# EAGLE design USB-to-Quad-RS-485-Conv-Module (EAGLE 9.6.2)
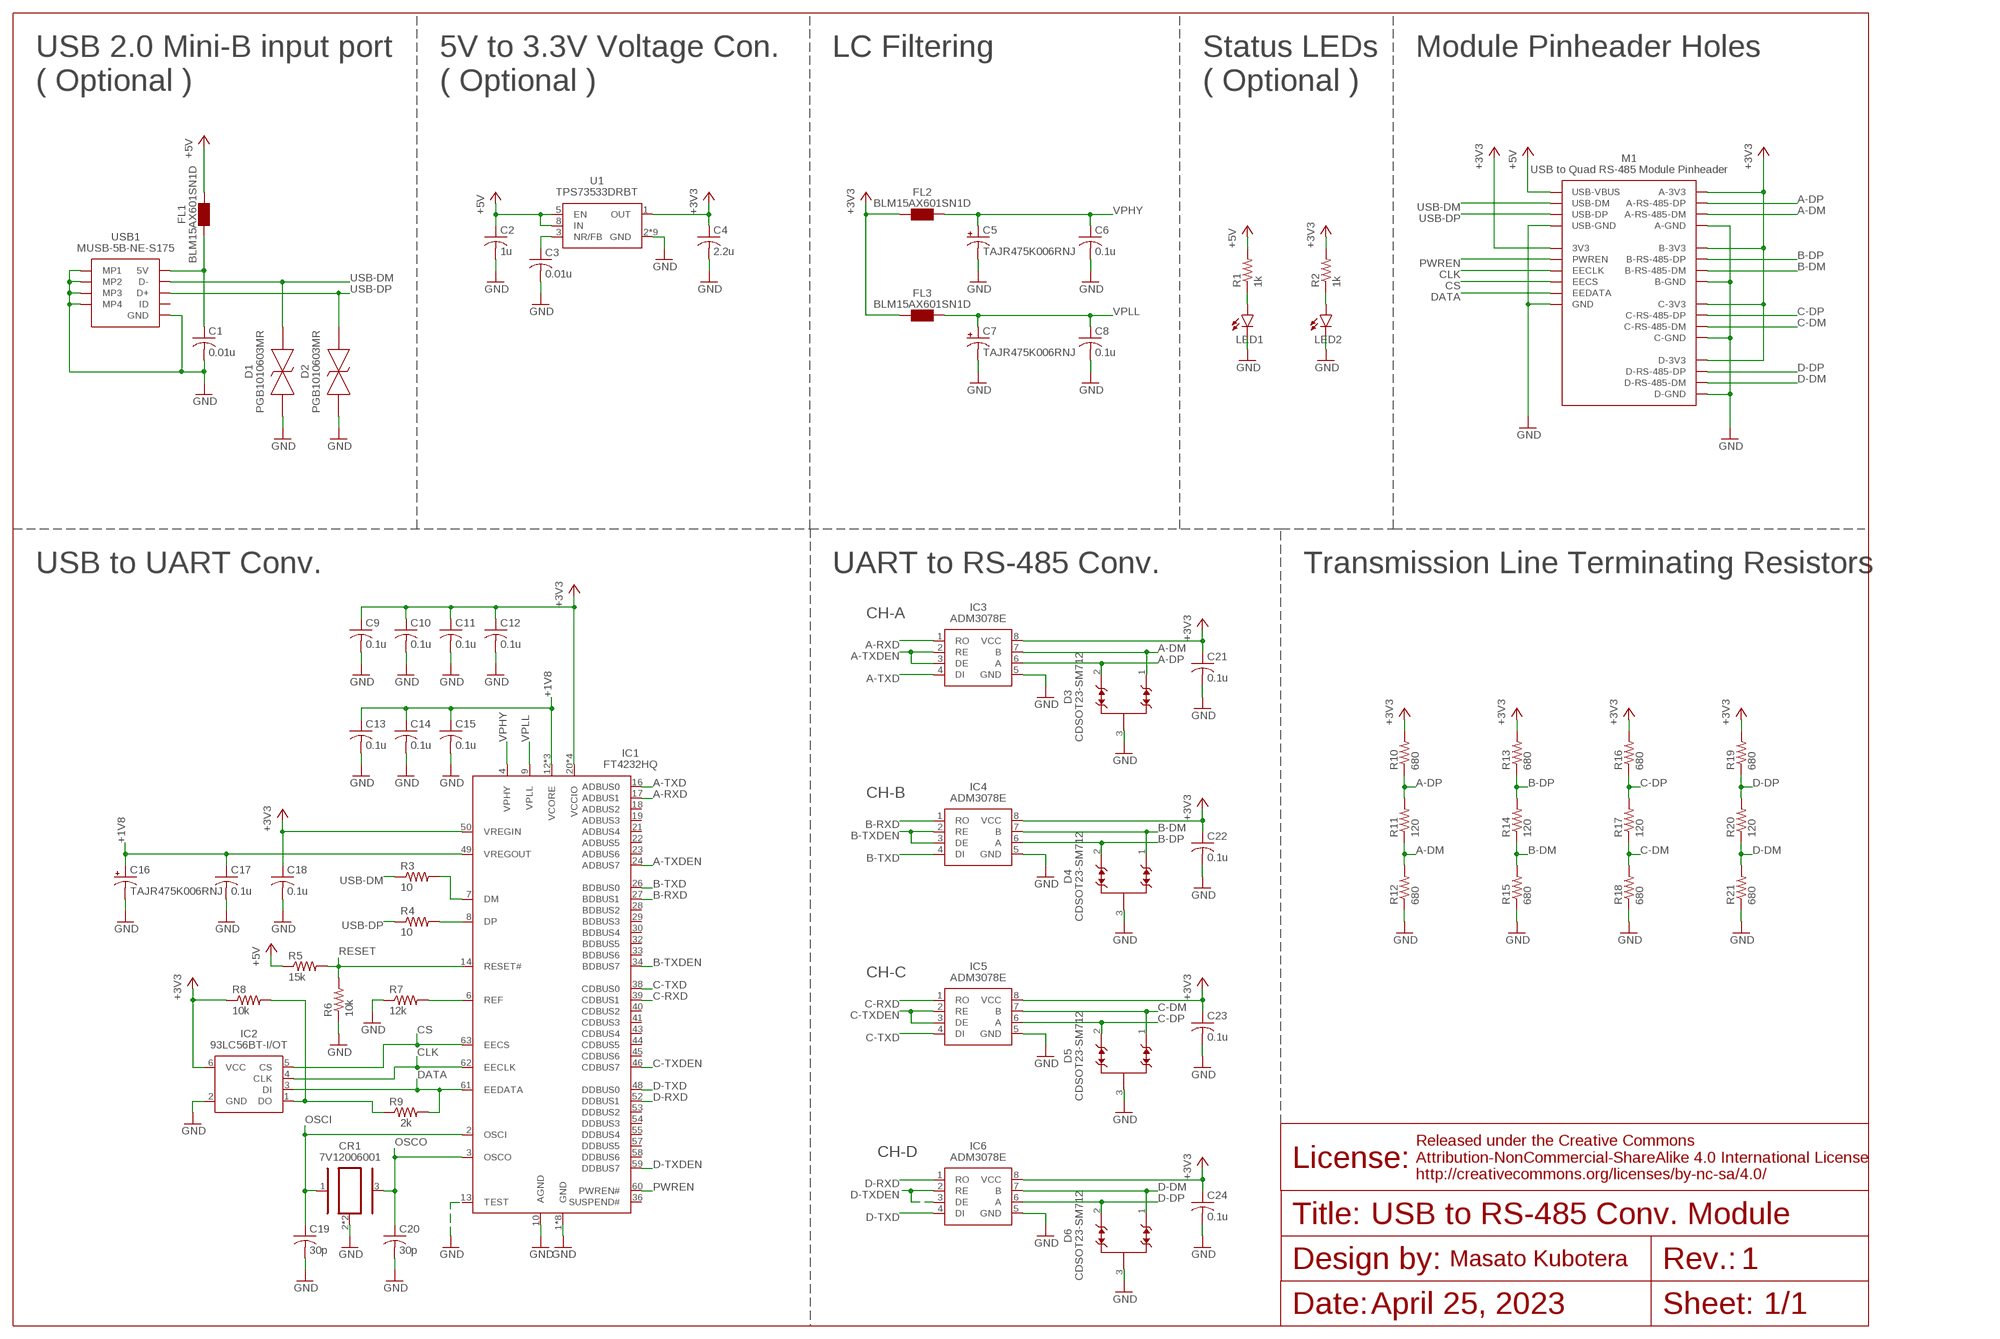
[diagram p0: schematic, sheet 1]

## Parts
C1  0.01u  C-USC0402  [C0402]
C2  1u  C-USC0402  [C0402]
C3  0.01u  C-USC0402  [C0402]
C4  2.2u  C-USC0402  [C0402]
C5  4.7u  TAJR475K006RNJ  [0805K]
C6  0.1u  C-USC0402  [C0402]
C7  4.7u  TAJR475K006RNJ  [0805K]
C8  0.1u  C-USC0402  [C0402]
C9  0.1u  C-USC0402  [C0402]
C10  0.1u  C-USC0402  [C0402]
C11  0.1u  C-USC0402  [C0402]
C12  0.1u  C-USC0402  [C0402]
C13  0.1u  C-USC0402  [C0402]
C14  0.1u  C-USC0402  [C0402]
C15  0.1u  C-USC0402  [C0402]
C16  4.7u  TAJR475K006RNJ  [0805K]
C17  0.1u  C-USC0402  [C0402]
C18  0.1u  C-USC0402  [C0402]
C19  30p  C-USC0402  [C0402]
C20  30p  C-USC0402  [C0402]
C21  0.1u  C-USC0402  [C0402]
C22  0.1u  C-USC0402  [C0402]
C23  0.1u  C-USC0402  [C0402]
C24  0.1u  C-USC0402  [C0402]
CR1  7V12006001  [7V12006001]
D1  PGB1010603MR  [0603]
D2  PGB1010603MR  [0603]
D3  CDSOT23-SM712  [SOT-23-3]
D4  CDSOT23-SM712  [SOT-23-3]
D5  CDSOT23-SM712  [SOT-23-3]
D6  CDSOT23-SM712  [SOT-23-3]
FL1  BLM15AX601SN1D  [BLM15AX601SN1D]
FL2  BLM15AX601SN1D  [BLM15AX601SN1D]
FL3  BLM15AX601SN1D  [BLM15AX601SN1D]
IC1  FT4232HQ  [FT4232HQ]
IC2  93LC56BT-I/OT  [SOT-23-6]
IC3  ADM3078E  [SOIC-8]
IC4  ADM3078E  [SOIC-8]
IC5  ADM3078E  [SOIC-8]
IC6  ADM3078E  [SOIC-8]
LED1  LEDSML0603  [SML0603]
LED2  LEDSML0603  [SML0603]
M1  USB-TO-QUAD-RS-485-CONV-MODULE  [USB-TO-QUAD-RS-485-CONV-MODULE-DIMENSION]
R1  1k  R-US_R0402  [R0402]
R2  1k  R-US_R0402  [R0402]
R3  10  R-US_R0402  [R0402]
R4  10  R-US_R0402  [R0402]
R5  15k  R-US_R0402  [R0402]
R6  10k  R-US_R0402  [R0402]
R7  12k  R-US_R0402  [R0402]
R8  10k  R-US_R0402  [R0402]
R9  2k  R-US_R0402  [R0402]
R10  680  R-US_R0402  [R0402]
R11  120  R-US_R0402  [R0402]
R12  680  R-US_R0402  [R0402]
R13  680  R-US_R0402  [R0402]
R14  120  R-US_R0402  [R0402]
R15  680  R-US_R0402  [R0402]
R16  680  R-US_R0402  [R0402]
R17  120  R-US_R0402  [R0402]
R18  680  R-US_R0402  [R0402]
R19  680  R-US_R0402  [R0402]
R20  120  R-US_R0402  [R0402]
R21  680  R-US_R0402  [R0402]
U1  TPS73533DRBT  [SON-8]
USB1  MINI_USB_B_SMD  [MINI_USB_B_SMD]

## Nets
+1V8 [power]: C13.1 C14.1 C15.1 C16.1(+) C17.1 IC1.12(VCORE) IC1.37(VCORE) IC1.49(VREGOUT) IC1.64(VCORE)
+3V3 [power]: C4.1 C9.1 C10.1 C11.1 C12.1 C18.1 C21.1 C22.1 C23.1 C24.1 FL2.1 FL3.1 IC1.20(VCCIO) IC1.31(VCCIO) IC1.42(VCCIO) IC1.50(VREGIN) IC1.56(VCCIO) IC2.6(VCC) IC3.8(VCC) IC4.8(VCC) IC5.8(VCC) IC6.8(VCC) M1.3V3 M1.A-3V3 M1.B-3.3V(B-3V3) M1.C-3V3 M1.D-3V3 R2.2 R8.1 R10.2 R13.2 R16.2 R19.2 U1.1(OUT)
+5V [power]: C2.1 FL1.2 M1.USB-VBUS R1.2 R5.1 U1.5(EN) U1.8(IN)
A-DM [signal]: D3.1 IC3.7(B) M1.A-RS-485-DM R11.1 R12.2
A-DP [signal]: D3.2 IC3.6(A) M1.A-RS-485-DP R10.1 R11.2
A-RXD [signal]: IC1.17(ADBUS1) IC3.1(RO)
A-TXD [signal]: IC1.16(ADBUS0) IC3.4(DI)
A-TXDEN [signal]: IC1.24(ADBUS7) IC3.2(RE) IC3.3(DE)
B-DM [signal]: D4.1 IC4.7(B) M1.B-RS-485-DM R14.1 R15.2
B-DP [signal]: D4.2 IC4.6(A) M1.B-RS-485-DP R13.1 R14.2
B-RXD [signal]: IC1.27(BDBUS1) IC4.1(RO)
B-TXD [signal]: IC1.26(BDBUS0) IC4.4(DI)
B-TXDEN [signal]: IC1.34(BDBUS7) IC4.2(RE) IC4.3(DE)
C-DM [signal]: D5.1 IC5.7(B) M1.C-RS-485-DM R17.1 R18.2
C-DP [signal]: D5.2 IC5.6(A) M1.C-RS-485-DP R16.1 R17.2
C-RXD [signal]: IC1.39(CDBUS1) IC5.1(RO)
C-TXD [signal]: IC1.38(CDBUS0) IC5.4(DI)
C-TXDEN [signal]: IC1.46(CDBUS7) IC5.2(RE) IC5.3(DE)
CLK [signal]: IC1.62(EECLK) IC2.4(CLK) M1.EECLK
CS [signal]: IC1.63(EECS) IC2.5(CS) M1.EECS
D-DM [signal]: D6.1 IC6.7(B) M1.D-RS-485-DM R20.1 R21.2
D-DP [signal]: D6.2 IC6.6(A) M1.D-RS-485-DP R19.1 R20.2
D-RXD [signal]: IC1.52(DDBUS1) IC6.1(RO)
D-TXD [signal]: IC1.48(DDBUS0) IC6.4(DI)
D-TXDEN [signal]: IC1.59(DDBUS7) IC6.2(RE) IC6.3(DE)
DATA [signal]: IC1.61(EEDATA) IC2.3(DI) M1.EEDATA R9.2
FT4232H-DM [signal]: IC1.7(DM) R3.2
FT4232H-DP [signal]: IC1.8(DP) R4.2
FT4232H-REF [signal]: IC1.6(REF) R7.2
GND [power]: C1.2 C2.2 C3.2 C4.2 C5.2(-) C6.2 C7.2(-) C8.2 C9.2 C10.2 C11.2 C12.2 C13.2 C14.2 C15.2 C16.2(-) C17.2 C18.2 C19.2 C20.2 C21.2 C22.2 C23.2 C24.2 CR1.2 CR1.4 D1.1 D2.1 D3.3 D4.3 D5.3 D6.3 IC1.1(GND) IC1.5(GND) IC1.10(AGND) IC1.11(GND) IC1.13(TEST) IC1.15(GND) IC1.25(GND) IC1.35(GND) IC1.47(GND) IC1.51(GND) IC2.2(GND) IC3.5(GND) IC4.5(GND) IC5.5(GND) IC6.5(GND) LED1.C LED2.C M1.A-GND M1.B-GND M1.C-GND M1.D-GND M1.GND1(GND) M1.USB-GND R6.1 R7.1 R12.1 R15.1 R18.1 R21.1 U1.2(GND) U1.4(GND) U1.6(GND) U1.7(GND) U1.9(GND) U1.10(GND) U1.11(GND) U1.12(GND) U1.13(GND) USB1.5(GND) USB1.MP1 USB1.MP2 USB1.MP3 USB1.MP4
LED_3V3: LED2.A R2.1
LED_5V: LED1.A R1.1
NR/FB [power]: C3.1 U1.3(NR/FB)
OSCI [signal]: C19.1 CR1.1 IC1.2(OSCI)
OSCO [signal]: C20.1 CR1.3 IC1.3(OSCO)
PULLUP-DATA [signal]: IC2.1(DO) R8.2 R9.1
PWREN [signal]: IC1.60(PWREN#) M1.PWREN
RESET [signal]: IC1.14(RESET#) R5.2 R6.2
USB-DM [signal]: D1.2 M1.USB-DM R3.1 USB1.2(D-)
USB-DP [signal]: D2.2 M1.USB-DP R4.1 USB1.3(D+)
VBUS [power]: C1.1 FL1.1 USB1.1(5V)
VPHY [power]: C5.1(+) C6.1 FL2.2 IC1.4(VPHY)
VPLL [power]: C7.1(+) C8.1 FL3.2 IC1.9(VPLL)
Unconnected: IC1.18(ADBUS2) IC1.19(ADBUS3) IC1.21(ADBUS4) IC1.22(ADBUS5) IC1.23(ADBUS6) IC1.28(BDBUS2) IC1.29(BDBUS3) IC1.30(BDBUS4) IC1.32(BDBUS5) IC1.33(BDBUS6) IC1.36(SUSPEND#) IC1.40(CDBUS2) IC1.41(CDBUS3) IC1.43(CDBUS4) IC1.44(CDBUS5) IC1.45(CDBUS6) IC1.53(DDBUS2) IC1.54(DDBUS3) IC1.55(DDBUS4) IC1.57(DDBUS5) IC1.58(DDBUS6) USB1.4(ID)

## Notes on the sheet
- USB 2.0 Mini-B input port
  ( Optional )
- 5V to 3.3V Voltage Con.
  ( Optional )
- LC Filtering
- Status LEDs
  ( Optional )
- Module Pinheader Holes
- USB to UART Conv. | UART to RS-485 Conv. | Transmission Line Terminating Resistors
- CH-A
- CH-B
- CH-C
- CH-D
- USB to RS-485 Conv. Module
- 1
- April 25, 2023 | 1/1

## Library data of the parts
C1-C4 C6 C8-C15 C17-C24 = rcl:C-US: CAPACITOR, American symbol; SPICEPREFIX: C
C5 C7 C16 = TAJR475K006RNJ:TAJR475K006RNJ
CR1 = 7V12006001:7V12006001
D1 D2 = PGB1010603MR:PGB1010603MR
D3-D6 = CDSOT23-SM712:CDSOT23-SM712
FL1-FL3 = BLM15AX601SN1D:BLM15AX601SN1D
IC1 = FT4232HQ:FT4232HQ
IC2 = 93LC56B:93LC56BT-I/OT
IC3-IC6 = ADM3078E:ADM3078E
LED1 LED2 = led:LED: LED OSRAM: - CHIPLED LG R971, LG N971, LY N971, LG Q971, LY Q971, LO R971, LY R971 LH N974, LH R974 LS Q976, LO Q976, LY Q976 LO Q996 - Hyper CHIPLED LW Q18S LB Q993, LB Q99A, LB R99A - SideLED LS A670, LO A670, LY A670, LG A670, LP A670 LB A673, LV A673, LT A673, LW A673 LH A674 LY A675 LS A676, LA A676, LO A676, LY A676, LW A676 LS A679, LY A679, LG A679 - Hyper Micro SIDELED® LS Y876, LA Y876, LO Y876, LY Y876 LT Y87S - SmartLED LW L88C, LW L88S LB L89C, LB L89S, LG L890 LS L89K, LO L89K, LY L89K LS L896, LA L896, LO L896, LY L896 - TOPLED LS T670, LO T670, LY T670, LG T670, LP T670 LSG T670, LSP T670, LSY T670, LOP T670, LYG T670 LG T671, LOG T671, LSG T671 LB T673, LV T673, LT T673, LW T673 LH T674 LS T676, LA T676, LO T676, LY T676, LB T676, LH T676, LSB T676, LW T676 LB T67C, LV T67C, LT T67C, LS T67K, LO T67K, LY T67K, LW E67C LS E67B, LA E67B, LO E67B, LY E67B, LB E67C, LV E67C, LT E67C LW T67C LS T679, LY T679, LG T679 LS T770, LO T770, LY T770, LG T770, LP T770 LB T773, LV T773, LT T773, LW T773 LH T774 LS E675, LA E675, LY E675, LS T675 LS T776, LA T776, LO T776, LY T776, LB T776 LHGB T686 LT T68C, LB T68C - Hyper Mini TOPLED® LB M676 - Mini TOPLED Santana® LG M470 LS M47K, LO M47K, LY M47K Source: http://www.osram.convergy.de LUXEON: - LUMILED® LXK2-PW12-R00, LXK2-PW12-S00, LXK2-PW14-U00, LXK2-PW14-V00 LXK2-PM12-R00, LXK2-PM12-S00, LXK2-PM14-U00 LXK2-PE12-Q00, LXK2-PE12-R00, LXK2-PE12-S00, LXK2-PE14-T00, LXK2-PE14-U00 LXK2-PB12-K00, LXK2-PB12-L00, LXK2-PB12-M00, LXK2-PB14-N00, LXK2-PB14-P00, LXK2-PB14-Q00 LXK2-PR12-L00, LXK2-PR12-M00, LXK2-PR14-Q00, LXK2-PR14-R00 LXK2-PD12-Q00, LXK2-PD12-R00, LXK2-PD12-S00 LXK2-PH12-R00, LXK2-PH12-S00 LXK2-PL12-P00, LXK2-PL12-Q00, LXK2-PL12-R00 Source: www.luxeon.com KINGBRIGHT: KA-3528ASYC Source: www.kingbright.com
M1 = USB-to-Quad-RS-485-Conv-Module:USB-TO-QUAD-RS-485-CONV-MODULE
R1-R21 = rcl:R-US_: RESISTOR, American symbol; SPICEPREFIX: R
U1 = TPS73533DRBT:TPS73533DRBT
USB1 = USB_Connector:MINI_USB_B_SMD

## Net classes
2 power: width 0.203 mm

## Board
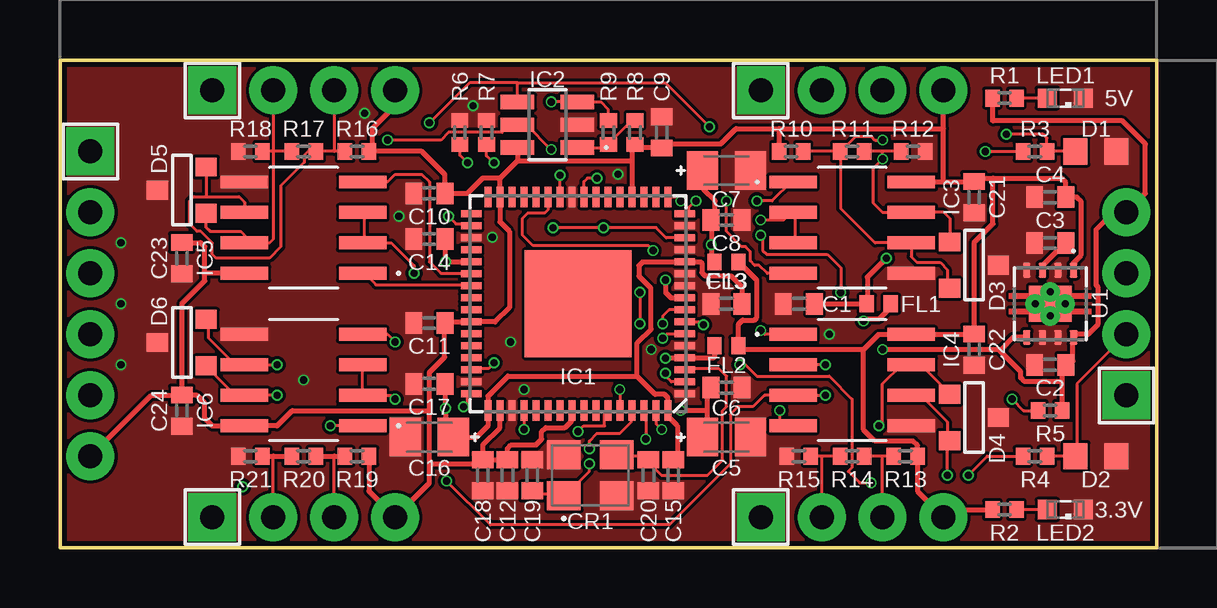
[diagram p1: board, top side]
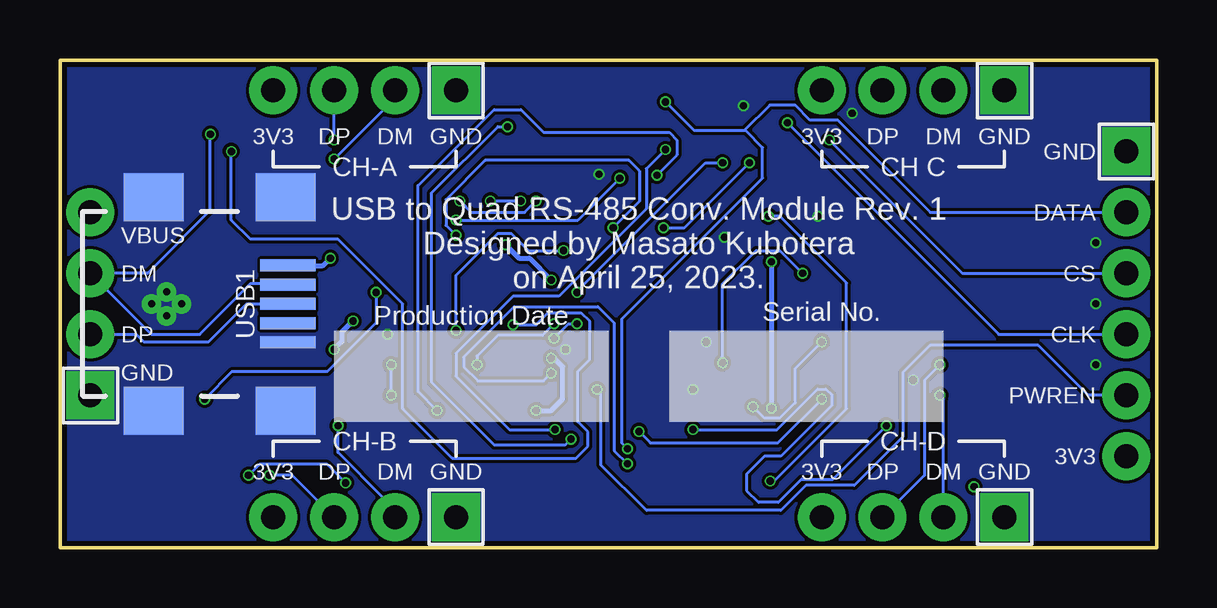
[diagram p2: board, bottom side, seen from below]

Size 45.72 x 20.32 mm. Coordinates in mm from the lower left corner, seen from the top.
Copper layers (1*16): Top 0.035mm / dielectric 1.6mm / Bottom 0.035mm
Design rules "jlcpcb-2layers": minimum track width 5mil, minimum drill 0.3mm, track to track 5mil, track to pad 5mil, pad to pad 5mil, via to via 5mil, smd to smd 5mil, copper to edge 0.2mm, drill to drill 6mil, minimum pad ring 10mil, minimum via ring 3mil, stop-mask expansion 4mil, vias tented up to drill 0mil, thermal gap 10mil

### Footprints (pad centres in the part's own frame; a part is rotated, then mirrored left to right if it is on the bottom)
C0402 = smd 0.7 x 0.9: 1 -0.65,0; 2 0.65,0
0805K = smd 1.3 x 1.6: 1 -1,0; 2 1,0
7V12006001 = smd 1.4 x 1.2: 1 -1.1,-0.85; 2 1.1,-0.85; 3 1.1,0.85; 4 -1.1,0.85
0603 = smd 1 x 1.1: 1 -0.85,0; 2 0.85,0
SOT-23-3 = smd 0.787 x 0.889: 1 0.991,1.016; 2 -0.94,1.016; 3 0.025,-1.016
BLM15AX601SN1D = smd 0.6 x 0.7: 1 -0.5,0; 2 0.5,0
FT4232HQ = smd 0.85 x 0.3: 1 -4.45,3.75; 2 -4.45,3.25; 3 -4.45,2.75; 4 -4.45,2.25; 5 -4.45,1.75; 6 -4.45,1.25; 7 -4.45,0.75; 8 -4.45,0.25; 9 -4.45,-0.25; 10 -4.45,-0.75; 11 -4.45,-1.25; 12 -4.45,-1.75; 13 -4.45,-2.25; 14 -4.45,-2.75; 15 -4.45,-3.25; 16 -4.45,-3.75; 33 4.45,-3.75; 34 4.45,-3.25; 35 4.45,-2.75; 36 4.45,-2.25; 37 4.45,-1.75; 38 4.45,-1.25; 39 4.45,-0.75; 40 4.45,-0.25; 41 4.45,0.25; 42 4.45,0.75; 43 4.45,1.25; 44 4.45,1.75; 45 4.45,2.25; 46 4.45,2.75; 47 4.45,3.25; 48 4.45,3.75 | smd 0.3 x 0.85: 17 -3.75,-4.45; 18 -3.25,-4.45; 19 -2.75,-4.45; 20 -2.25,-4.45; 21 -1.75,-4.45; 22 -1.25,-4.45; 23 -0.75,-4.45; 24 -0.25,-4.45; 25 0.25,-4.45; 26 0.75,-4.45; 27 1.25,-4.45; 28 1.75,-4.45; 29 2.25,-4.45; 30 2.75,-4.45; 31 3.25,-4.45; 32 3.75,-4.45; 49 3.75,4.45; 50 3.25,4.45; 51 2.75,4.45; 52 2.25,4.45; 53 1.75,4.45; 54 1.25,4.45; 55 0.75,4.45; 56 0.25,4.45; 57 -0.25,4.45; 58 -0.75,4.45; 59 -1.25,4.45; 60 -1.75,4.45; 61 -2.25,4.45; 62 -2.75,4.45; 63 -3.25,4.45; 64 -3.75,4.45 | smd 4.45 x 4.45: 65 0,0
SOT-23-6 = smd 1.4 x 0.6: 1 -1.25,0.95; 2 -1.25,0; 3 -1.25,-0.95; 4 1.25,-0.95; 5 1.25,0; 6 1.25,0.95
SOIC-8 = smd 1.981 x 0.533: 1 -2.464,1.905; 2 -2.464,0.635; 3 -2.464,-0.635; 4 -2.464,-1.905; 5 2.464,-1.905; 6 2.464,-0.635; 7 2.464,0.635; 8 2.464,1.905
SML0603 = smd 0.8 x 0.8: A 0.75,0; C -0.75,0
USB-TO-QUAD-RS-485-CONV-MODULE-DIMENSION = drill 1 pad 2: 3V3 1.27,3.81; A-3V3 36.83,19.05; A-RS-485-DM 31.75,19.05; A-RS-485-DP 34.29,19.05; B-3.3V 36.83,1.27; B-RS-485-DM 31.75,1.27; B-RS-485-DP 34.29,1.27; C-3V3 13.97,19.05; C-RS-485-DM 8.89,19.05; C-RS-485-DP 11.43,19.05; D-3V3 13.97,1.27; D-RS-485-DM 8.89,1.27; D-RS-485-DP 11.43,1.27; EECLK 1.27,8.89; EECS 1.27,11.43; EEDATA 1.27,13.97; PWREN 1.27,6.35; USB-DM 44.45,11.43; USB-DP 44.45,8.89; USB-VBUS 44.45,13.97 | drill 1 pad 2 square: A-GND 29.21,19.05; B-GND 29.21,1.27; C-GND 6.35,19.05; D-GND 6.35,1.27; GND1 1.27,16.51; USB-GND 44.45,6.35
R0402 = smd 0.6 x 0.7: 1 -0.5,0; 2 0.5,0
SON-8 = smd 0.6 x 0.31: 1 -1.4,0.975; 2 -1.4,0.325; 3 -1.4,-0.325; 4 -1.4,-0.975; 5 1.4,-0.975; 6 1.4,-0.325; 7 1.4,0.325; 8 1.4,0.975 | smd 1.5 x 1.75: 9 0,0 | drill 0.3: 10 0,0.625; 11 0.5,0; 12 -0.5,0; 13 0,-0.625
MINI_USB_B_SMD = smd 0.5 x 2.3: 1 -1.6,8.55; 2 -0.8,8.55; 3 0,8.55; 4 0.8,8.55; 5 1.6,8.55 | smd 2 x 2.5: MP1 -4.45,8.45; MP2 4.45,8.45; MP3 4.45,2.95; MP4 -4.45,2.95

### Placement (x,y rotation side)
C1  30.8,10.16 180 top
C2  41.27,7.62 180 top
C3  41.27,12.7 180 top
C4  41.27,14.61 180 top
C5  27.78,4.6 0 top
C6  27.78,6.67 0 top
C7  27.78,15.72 0 top
C8  27.78,13.65 0 top
C9  25.08,17.3 90 top
C10  15.4,14.76 180 top
C11  15.4,9.37 180 top
C12  18.65,3.02 270 top
C13  27.78,10.16 180 top
C14  15.4,12.86 180 top
C15  25.56,3.02 270 top
C16  15.4,4.6 180 top
C17  15.4,6.83 180 top
C18  17.62,3.02 270 top
C19  19.68,3.02 90 top
C20  24.53,3.02 270 top
C21  38.1,14.61 270 top
C22  38.1,8.26 270 top
C23  5.08,12.06 270 top
C24  5.08,5.71 270 top
CR1  22.11,3.02 0 top
D1  43.18,16.51 180 top
D2  43.18,3.81 180 top
D3  38.1,11.75 90 top
D4  38.1,5.4 90 top
D5  5.08,14.92 270 top
D6  5.08,8.57 270 top
FL1  34.13,10.16 0 top
FL2  27.78,8.41 180 top
FL3  27.78,11.91 180 top
IC1  21.59,10.16 180 top
IC2  20.32,17.62 180 top
IC3  33.02,13.34 0 top
IC4  33.02,6.99 0 top
IC5  10.16,13.34 180 top
IC6  10.16,6.99 180 top
LED1  41.91,18.73 180 top
LED2  41.91,1.59 180 top
M1  0,0 0 top
R1  39.37,18.73 180 top
R2  39.37,1.59 180 top
R3  40.64,16.51 180 top
R4  40.64,3.81 180 top
R5  41.27,5.71 180 top
R6  16.67,17.3 270 top
R7  17.78,17.3 270 top
R8  23.97,17.3 90 top
R9  22.86,17.3 90 top
R10  30.48,16.51 180 top
R11  33.02,16.51 180 top
R12  35.56,16.51 180 top
R13  35.24,3.81 0 top
R14  33.02,3.81 0 top
R15  30.8,3.81 0 top
R16  12.38,16.51 0 top
R17  10.16,16.51 0 top
R18  7.94,16.51 0 top
R19  12.38,3.81 0 top
R20  10.16,3.81 0 top
R21  7.94,3.81 0 top
U1  41.27,10.16 270 top
USB1  44.77,10.16 270 bottom

### Tracks (layer width: path | path; a pad name or v marks a point on that pad's centre or on a via)
+1V8  (via drill 0.3)
  Top 0.203: C15.1 25.74,3.84 25.74,5.08 25.34,5.47 IC1.64 25.34,6.25 25.2,6.39 24.8,6.39 24.05,7.14 | C13.1 28.43,10.87 27.98,11.33 26.89,11.33 26.75,11.46 26.75,11.86 26.7,11.91 IC1.12 24.29,11.91 24.13,11.75 24.13,11.32 24.62,10.82 24.62,9.13 24.65,9.11 24.05,8.52 24.05,7.14 | IC1.37 v16.07,11.91 16.07,12.83 C14.1 | C17.1 16.07,6.79 v16.07,5.81 16.07,4.6 C16.1 17.37,4.6 17.84,5.08 IC1.49 17.84,6.31 17.94,6.41 18.67,7.14 24.05,7.14
  Bottom 0.203: v16.07,11.91 v16.07,5.81
+3V3
  Top 0.203: IC1.50 18.34,5 17.62,4.29 C18.1 | IC1.56 21.34,5.3 21.04,5 20.24,5 20.08,4.84 20.08,4.52 19.84,4.29 18.81,4.29 18.65,4.13 C12.1 | R19.2 12.88,2.36 M1.D-3V3 15.4,2.7 15.4,3.49 | 15.4,3.49 15.4,5.71 | 15.4,5.71 15.4,7.3 16.03,7.94 16.03,9.37 C11.1 16.09,9.41 IC1.42 18.14,9.41 18.74,10.01 18.74,13.18 18.34,13.58 IC1.31 | C18.1 17.62,3.49 15.4,3.49 | C23.1 5.86,12.71 6.03,12.54 6.03,11.43 | 7.46,11.27 7.62,11.43 IC5.8 6.03,11.43 | 5.08,6.35 3.81,6.35 M1.3V3 | 5.08,6.35 C24.1 5.08,10.16 6.03,11.11 6.03,11.43 | 15.4,5.71 9.68,5.71 9.05,5.08 IC6.8 6.35,5.08 6.03,5.4 6.03,6.03 5.71,6.35 5.08,6.35 | 35.88,3.81 R13.2 | FL3.1 29.05,11.14 29.05,9.58 28.95,9.48 28.45,9.48 28.28,9.31 FL2.1 28.28,8.26 33.5,8.26 | 33.5,8.26 34.13,8.89 IC4.8 38.1,8.89 C22.1 38.1,12.7 38.89,13.49 38.89,15.4 | R13.2 35.74,4.26 35.56,4.45 33.97,4.45 33.5,4.92 33.5,8.26 | U1.1 42.25,11.88 42.55,12.17 42.55,14.45 42.39,14.61 C4.1 41.92,15.22 41.75,15.4 38.89,15.4 | IC3.8 36.83,15.24 | 36.83,15.24 38.1,15.24 C21.1 38.27,15.26 38.42,15.4 38.89,15.4 | 36.83,15.24 36.83,17.46 | 36.83,17.46 M1.A-3V3 | 23.97,16.67 25.08,16.67 C9.1 25.26,16.83 27.55,16.83 28.18,17.46 29.98,17.46 | R10.2 29.98,17.46 | 23.97,16.67 23.84,16.53 23.84,16.52 23.84,16.11 | 23.84,16.11 IC1.20 | 23.97,16.67 R8.1 | IC2.6 19.07,16.11 | IC1.31 18.34,15.38 19.07,16.11 | 13.02,16.51 13.02,17.46 13.97,18.41 M1.C-3V3 | 13.02,16.51 R16.2 | 16.03,14.76 C10.1 | C10.1 16.99,14.76 17.62,15.4 18.34,15.4 IC1.31 | 29.98,17.46 36.83,17.46 | C12.1 18.65,3.97 | C18.1 C12.1 | 19.07,16.11 23.84,16.11 | C10.1 16.05,15.54 15.08,16.51 13.02,16.51 | R13.2 35.74,2.36 M1.B-3.3V 37.15,1.59 R2.2
+5V  (via drill 0.3)
  Top 0.203: U1.5 39.72,8.76 39.21,8.26 39.13,8.26 | 41.75,7.46 C2.1 | C2.1 42.07,7.62 42.23,7.78 42.23,8.73 U1.8 42.39,8.89 42.86,8.89 43.26,9.29 43.26,10.87 43.18,10.95 43.18,13.26 43.89,13.97 M1.USB-VBUS 45.24,14.76 45.24,16.83 44.29,17.78 38.89,17.78 38.87,17.8 R1.2 | FL1.2 34.63,10.03 34.13,9.53 33.58,9.53 v33.5,9.45 | 39.13,8.26 v34.29,8.26 | 41.75,7.46 41.75,6.91 | 41.75,6.91 41.75,5.71 R5.1 | 41.75,7.46 C2.1 | 39.13,8.26 40.05,7.34 40.05,7.08 40.18,6.94 41.72,6.94 41.75,6.91
  Bottom 0.203: v34.29,8.26 33.97,8.57 33.97,8.97 v33.5,9.45
A-DM  (via drill 0.3)
  Top 0.127: R12.2 34.29,16.51 | 34.29,16.51 R11.1 | D3.1 37.08,13.73 36.85,13.97 IC3.7 34.29,13.97 33.89,14.37 33.89,15.8 v34.29,16.19 34.29,16.51
  Bottom 0.127: v34.29,16.19 31.75,18.73 M1.A-RS-485-DM
A-DP  (via drill 0.3)
  Top 0.127: R10.1 R11.2 32.54,16.51 | 35.72,12.86 35.56,12.7 IC3.6 | D3.2 36.99,10.95 36.99,11.59 36.69,11.89 35.72,11.89 35.48,12.12 IC3.6 | 32.54,16.51 32.54,14.13 33.97,12.7 IC3.6 | v34.29,16.99 33.97,16.99 33.81,17.14 33.18,17.14 32.54,16.51
  Bottom 0.127: v34.29,16.99 M1.A-RS-485-DP
A-RXD  (via drill 0.3)
  Top 0.127: v25.88,14.45 25.88,14.53 25.79,14.61 IC1.17 | v29.05,14.45 29.69,14.45 30.48,15.24 IC3.1
  Bottom 0.127: v25.88,14.45 26.35,13.97 28.57,13.97 v29.05,14.45
A-TXD  (via drill 0.3)
  Top 0.127: v26.51,14.45 26.47,14.45 26.19,14.17 26.19,13.97 IC1.16 | v27.78,14.45 27.78,13.18 28.42,12.54 28.57,12.54 28.57,12.53 28.77,12.34 28.77,11.95 28.95,11.77 29.14,11.77 29.48,11.43 IC3.4 30.64,11.43
  Bottom 0.127: v27.78,14.45 v26.51,14.45
A-TXDEN  (via drill 0.3)
  Top 0.127: v22.38,15.4 21.99,15.4 21.84,15.25 IC1.24 | v29.21,13.65 30.16,13.65 30.48,13.97 IC3.2 30.64,13.97 30.64,12.7 IC3.3
  Bottom 0.127: v29.21,13.65 24.13,13.65 v22.38,15.4
B-DM  (via drill 0.3)
  Top 0.127: D4.1 36.99,6.51 35.72,7.78 35.56,7.62 IC4.7 35.08,7.62 34.29,6.83 34.29,5.24 v34.13,5.08 | R14.1 31.75,3.81 | 31.75,3.81 R15.2 | M1.B-RS-485-DM 31.75,3.81
  Bottom 0.127: v34.13,5.08 34.13,3.97 32.23,2.06 32.23,1.75 M1.B-RS-485-DM
B-DP  (via drill 0.3)
  Top 0.127: IC4.6 35.56,6.35 35.72,6.51 36.99,5.24 36.99,4.6 D4.2 36.99,4.45 v36.99,3.02 | R13.1 34.29,3.81 | 34.29,3.81 R14.2 | M1.B-RS-485-DP 34.29,3.81
  Bottom 0.127: v36.99,3.02 36.04,3.02 M1.B-RS-485-DP
B-RXD  (via drill 0.3)
  Top 0.127: v24.73,12.38 24.53,12.58 19.73,12.58 19.29,13.02 19.29,13.73 19.51,13.95 20.22,13.95 20.34,14.07 IC1.27 | v29.21,9.05 29.37,8.89 30.16,8.89 30.32,8.73 30.48,8.89 IC4.1
  Bottom 0.127: v24.73,12.38 26.19,12.38 26.91,13.1 27.46,13.1 29.21,11.35 v29.21,9.05
B-TXD  (via drill 0.3)
  Top 0.127: IC1.26 v20.84,15.52 | IC4.4 30,5.08 v30,5.71
  Bottom 0.127: v20.84,15.52 20,16.36 20,16.99 20.32,17.3 25.56,17.3 26.51,18.26 27.62,18.26 30.8,15.08 30.8,6.51 v30,5.71
B-TXDEN  (via drill 0.3)
  Top 0.127: v16.19,13.81 16.51,13.49 16.99,13.49 IC1.34 | v16.11,2.78 17.94,0.95 25.4,0.95 27.94,3.49 27.94,5.56 28.26,5.87 28.89,5.87 29.37,6.35 IC4.3 v31.91,6.35 | v31.91,7.62 IC4.2
  Bottom 0.127: v16.19,13.81 15.72,13.81 12.94,11.03 12.94,5.79 15.95,2.78 v16.11,2.78 | v31.91,6.35 v31.91,7.62
C-DM
  Top 0.127: R17.1 8.89,16.51 | 8.89,16.51 R18.2 | M1.C-RS-485-DM 8.89,16.51 | 8.89,16.51 8.89,12.86 8.73,12.7 IC5.7 7.7,13.02 7.54,13.18 6.25,13.18 6.1,13.34 D5.1
C-DP
  Top 0.127: D5.2 6.1,14.62 | R16.1 11.43,16.51 | 11.43,16.51 R17.2 10.34,16.51 10.18,16.35 10.18,16.06 9.21,15.08 9.21,12.54 8.73,12.06 6.51,12.06 6.35,12.22 6.35,12.7 5.87,13.18 5.71,13.18 5.4,13.49 5.4,14.45 5.58,14.62 6.1,14.62 | M1.C-RS-485-DP 11.43,16.51 | IC5.6 7.7,14.39 7.46,14.62 6.1,14.62
C-RXD
  Top 0.127: IC1.39 16.99,10.95 13.18,10.95 12.7,11.43 IC5.1
C-TXD
  Top 0.127: IC1.38 16.99,11.43 15.88,11.43 15.4,11.91 15.4,15.24 15.08,15.56 13.97,15.56 13.65,15.24 IC5.4
C-TXDEN  (via drill 0.3)
  Top 0.127: v18.1,7.7 17.86,7.46 17.14,7.46 IC1.46 | 12.7,12.86 12.54,12.7 IC5.2 | 12.7,12.86 12.7,13.97 IC5.3 | 12.7,12.86 IC5.2 | IC5.2 13.81,12.7 14.76,11.75 v14.76,11.43
  Bottom 0.127: v18.1,7.7 18.1,10.99 16.71,12.38 15.72,12.38 v14.76,11.43
CLK  (via drill 0.3)
  Top 0.127: v27.07,17.54 25.24,19.37 19.07,19.37 | IC1.62 24.42,5.63 v24.42,4.52 | v15.4,17.7 17.07,19.37 19.07,19.37 | IC2.4 19.07,19.37
  Bottom 0.127: v24.42,4.52 24.66,4.29 27.62,4.29 30.24,6.91 30.24,14.76 27.46,17.54 v27.07,17.54 | M1.EECLK 6.59,8.89 v15.4,17.7
CS  (via drill 0.3)
  Top 0.127: IC1.63 24.84,5.16 v25.08,4.92 | v20.48,16.59 19.45,17.62 IC2.5 18.75,17.62 18.43,17.3 16.19,17.3 15.88,16.99 v13.65,16.99
  Bottom 0.127: v25.08,4.92 26.99,4.92 29.21,7.14 29.21,8.1 26.83,10.48 24.92,10.48 21.27,14.13 21.27,15.8 v20.48,16.59 | M1.EECS 8.1,11.43 v13.65,16.99
D-DM  (via drill 0.3)
  Top 0.127: 7.46,6.19 7.3,6.35 | 7.3,6.35 6.19,7.46 D6.1 | 7.46,6.19 7.62,6.35 IC6.7 7.46,6.19 | M1.D-RS-485-DM 8.89,3.81 | v9.05,6.35 7.3,6.35
  Top 0.203: R21.2 8.89,3.81 R20.1
  Bottom 0.127: v9.05,6.35 8.89,6.19 M1.D-RS-485-DM
D-DP  (via drill 0.3)
  Top 0.127: 7.46,7.46 6.19,8.73 6.19,9.37 D6.2 | 7.46,7.46 7.62,7.62 IC6.6 | M1.D-RS-485-DP 11.43,3.81 | IC6.6 v9.05,7.62 | 7.46,7.46 IC6.6
  Top 0.203: R20.2 11.43,3.81 R19.1
  Bottom 0.127: v9.05,7.62 9.68,6.99 9.68,3.02 M1.D-RS-485-DP
D-RXD  (via drill 0.3)
  Top 0.127: IC1.52 v19.34,4.92 | IC6.1 v11.27,5.08
  Bottom 0.127: v19.34,4.92 15.83,4.92 14.14,6.61 13.8,6.61 13.55,6.36 13.55,5.93 15.67,3.81 16.35,3.81 17.1,3.06 17.1,2.38 16.6,1.89 15.78,1.89 14.81,2.86 13.49,2.86 v11.27,5.08
D-TXD  (via drill 0.3)
  Top 0.127: v16.83,5.87 16.99,6.03 16.99,6.35 IC1.48 | v13.97,8.57 13.65,8.89 IC6.4
  Bottom 0.127: v13.97,8.57 15.08,7.46 15.08,6.03 15.72,5.39 16.24,5.39 16.24,5.4 16.35,5.4 v16.83,5.87
D-TXDEN  (via drill 0.3)
  Top 0.127: v21.59,4.84 21.83,5.08 22.7,5.08 22.7,5.56 IC1.59 | 12.54,7.62 IC6.3 IC6.2 12.7,6.35 12.7,6.51 | v13.97,6.19 13.81,6.35 13.26,6.35
  Top 0.203: IC6.2 13.26,6.35
  Bottom 0.127: v21.59,4.84 21.11,4.37 15.8,4.37 v13.97,6.19
DATA  (via drill 0.3)
  Top 0.127: R9.2 22.86,18.26 22.55,18.57 IC2.3 v20.48,18.57 | v22.07,4.13 22.07,4.45 22.38,4.76 23.34,4.76 23.81,5.24 23.81,5.56 IC1.61
  Bottom 0.127: v22.07,4.13 22.3,4.37 22.3,9.53 16.43,15.4 16.43,16.67 17.14,17.38 17.18,17.38 | 17.18,17.38 19.29,17.38 v20.48,18.57 | M1.EEDATA 9.45,13.97 13.29,17.82 14.45,17.82 15.07,18.43 16.13,18.43 17.18,17.38
FT4232H-DM  (via drill 0.3)
  Top 0.127: v38.58,16.51 R3.2 | IC1.7 26.71,9.41 v26.83,9.29
  Bottom 0.127: v38.58,16.51 38.58,13.65 37.78,12.86 34.13,12.86 31.43,10.16 31.43,5.79 29.37,3.73 24.21,3.73 23.71,4.23 23.71,4.82 24.13,5.24 24.13,7.35 23.63,7.84 23.63,9.43 23.97,9.76 25.4,9.76 25.88,9.29 v26.83,9.29
FT4232H-DP  (via drill 0.3)
  Top 0.127: R4.2 38.66,3.81 v37.86,3.02 | v33.81,2.7 33.34,2.7 32.86,3.17 33.02,3.33 33.02,6.19 32.07,7.14 29.05,7.14 28.57,7.62 v28.34,7.62 | v25.12,9.33 25.12,9.64 25.39,9.91 IC1.8
  Bottom 0.127: v37.86,3.02 37.39,3.49 34.61,3.49 v33.81,2.7 | v28.34,7.62 28.34,7.98 27.46,8.85 25.6,8.85 v25.12,9.33
FT4232H-REF  (via drill 0.3)
  Top 0.127: R7.2 17.78,16.33 18.07,16.03 v18.1,16.03 | v24.17,10.64 v24.17,9.33 | v25.12,8.73 25.28,8.89 26.04,8.89 IC1.6
  Bottom 0.127: v18.1,16.03 18.81,16.03 24.17,10.68 v24.17,10.64 | v25.12,8.73 24.53,9.33 v24.17,9.33
GND  (via drill 0.3)
  Top 0.203: 17.14,13.02 IC1.35
  other vias: 2.54,7.62 2.54,12.7 2.54,10.16 17.22,18.41 14.13,13.81 12.7,18.1 24.65,8.26 32.07,8.89 23.26,15.56 18.02,12.94 10.16,6.99 19.34,6.59 18.78,8.57
  pour Top (no thermals): -1.27,21.59 -1.27,-1.27 46.99,-1.27 46.99,21.59
  pour Bottom (no thermals): -2.54,22.86 -2.54,-2.54 48.26,-2.54 48.26,22.86
GND1  (via drill 0.3)
  other vias: 7.62,2.54
LED_3V3
  Top 0.127: LED2.A R2.1
LED_5V
  Top 0.127: LED1.A R1.1
NR/FB
  Top 0.203: U1.3 40.96,11.59 40.96,11.75 C3.1
OSCI  (via drill 0.3)
  Top 0.127: IC1.2 25.48,6.91 25.24,7.14 v25.24,7.26 | v22.07,3.49 22.07,3.17 21.11,2.22 CR1.1 20.95,2.22 19.68,2.22 C19.1
  Bottom 0.127: v25.24,7.26 25.56,6.95 28.3,6.95 28.89,7.54 28.89,7.94 26.79,10.04 23.3,10.04 22.62,9.37 22.62,4.05 v22.07,3.49
OSCO
  Top 0.127: IC1.3 26.19,7.46 27.46,7.46 27.78,7.14 27.78,5.87 27.62,5.71 27.62,3.65 26.99,3.02 25.08,3.02 24.45,3.65 C20.1 24.45,3.81 23.34,3.81 CR1.3
PULLUP-DATA
  Top 0.127: IC2.1 21.75,16.67 22.86,16.67 R9.1 22.86,16.83 23.81,17.78 23.97,17.78 R8.2
PWREN  (via drill 0.3)
  Top 0.127: v23.34,6.59 v23.34,6.58 IC1.60
  Bottom 0.127: M1.PWREN 2.86,6.35 4.94,8.43 9.46,8.43 10.58,7.32 10.58,4.63 12.61,2.6 14.63,2.6 15.68,1.55 21.27,1.55 23.18,3.46 23.18,6.43 v23.34,6.59
RESET  (via drill 0.3)
  Top 0.127: R5.2 40.16,5.71 v39.69,6.19 | v32.54,10.64 32.54,11.67 31.99,12.22 29.45,12.22 29.29,12.38 29.29,12.94 v29.21,13.02 | IC1.14 25.27,12.91 24.84,13.34 v22.66,13.34 v20.56,13.34 | R6.2 16.67,16.35 v16.99,16.03
  Bottom 0.127: v39.69,6.19 38.54,7.34 34.57,7.34 32.54,9.37 v32.54,10.64 | v22.66,13.34 21.57,14.43 21.57,15.7 22.01,16.13 28,16.13 29.63,14.51 29.63,13.43 v29.21,13.02 | v20.56,13.34 19.68,13.34 v16.99,16.03
USB-DM  (via drill 0.3)
  Top 0.127: D1.2 R3.1 41.14,17.07 40.98,17.22 v39.45,17.22
  Bottom 0.127: v39.45,17.22 39.45,14.05 42.07,11.43 M1.USB-DM 41.91,8.89 39.89,8.89 37.76,11.02 36.27,11.02 | 36.35,11.11 36.27,11.02 | 36.27,11.02 USB1.2
USB-DP
  Top 0.127: R4.1 D2.2 42.39,3.81 42.39,6.83 M1.USB-DP
  Bottom 0.127: USB1.3 37.94,10.16 39.53,8.57 42.23,8.57 42.55,8.89 M1.USB-DP
VBUS  (via drill 0.3)
  Top 0.203: C1.1 FL1.1 33.66,10.16 33.66,11.27 v34.45,12.06
  Bottom 0.203: v34.45,12.06 34.77,11.75 36.2,11.75 USB1.1
VPHY  (via drill 0.3)
  Top 0.203: FL2.2 27.28,7.95 27.23,7.9 26.05,7.9 IC1.4 26.03,7.9 v25.24,7.9 | 26.99,5.71 26.99,4.76 26.83,4.6 C5.1 | 26.99,5.71 26.99,6.67 C6.1 | 26.99,5.71 v25.88,5.71
  Bottom 0.203: v25.24,7.9 25.12,7.9 24.77,7.54 24.77,6.19 25.24,5.71 v25.88,5.71
VPLL  (via drill 0.3)
  Top 0.203: 27.15,13.65 v27.15,12.62 27.15,11.91 FL3.2 | IC1.9 26.03,10.4 25.48,10.4 25.24,10.64 v25.24,11.15 | 27.15,13.65 27.3,13.81 27.3,14.45 26.83,14.92 26.83,15.72 C7.1 | 27.15,13.65 C8.1
  Bottom 0.203: v27.15,12.62 26.59,12.06 26.15,12.06 v25.24,11.15

### Text on the board
tPlace: 5V | 3.3V
bPlace: GND | GND | DM | DP | 3V3 | GND | DM | DP | 3V3 | CH C | CH-A | DATA | USB to Quad RS-485 Conv. Module Rev. 1 / Designed by Masato Kubotera / on April 25, 2023. | VBUS | CS | DM | Serial No. | Production Date | CLK | DP | GND | PWREN | 3V3 | CH-D | CH-B | GND | DM | DP | 3V3 | GND | DM | DP | 3V3